# EasyEDA Pro project ProPrj_火车手动控制开关_2025-05-28.epro, schematic Schematic2
Board Name: PCB2; Create Date: 2025-04-24; Page Name: P1; Project Name: 火车手动控制开关; Schematic Name: Schematic2; Update Date: 2025-04-25; Company: 嘉立创EDA; Page Size: A4; Version: V1.0
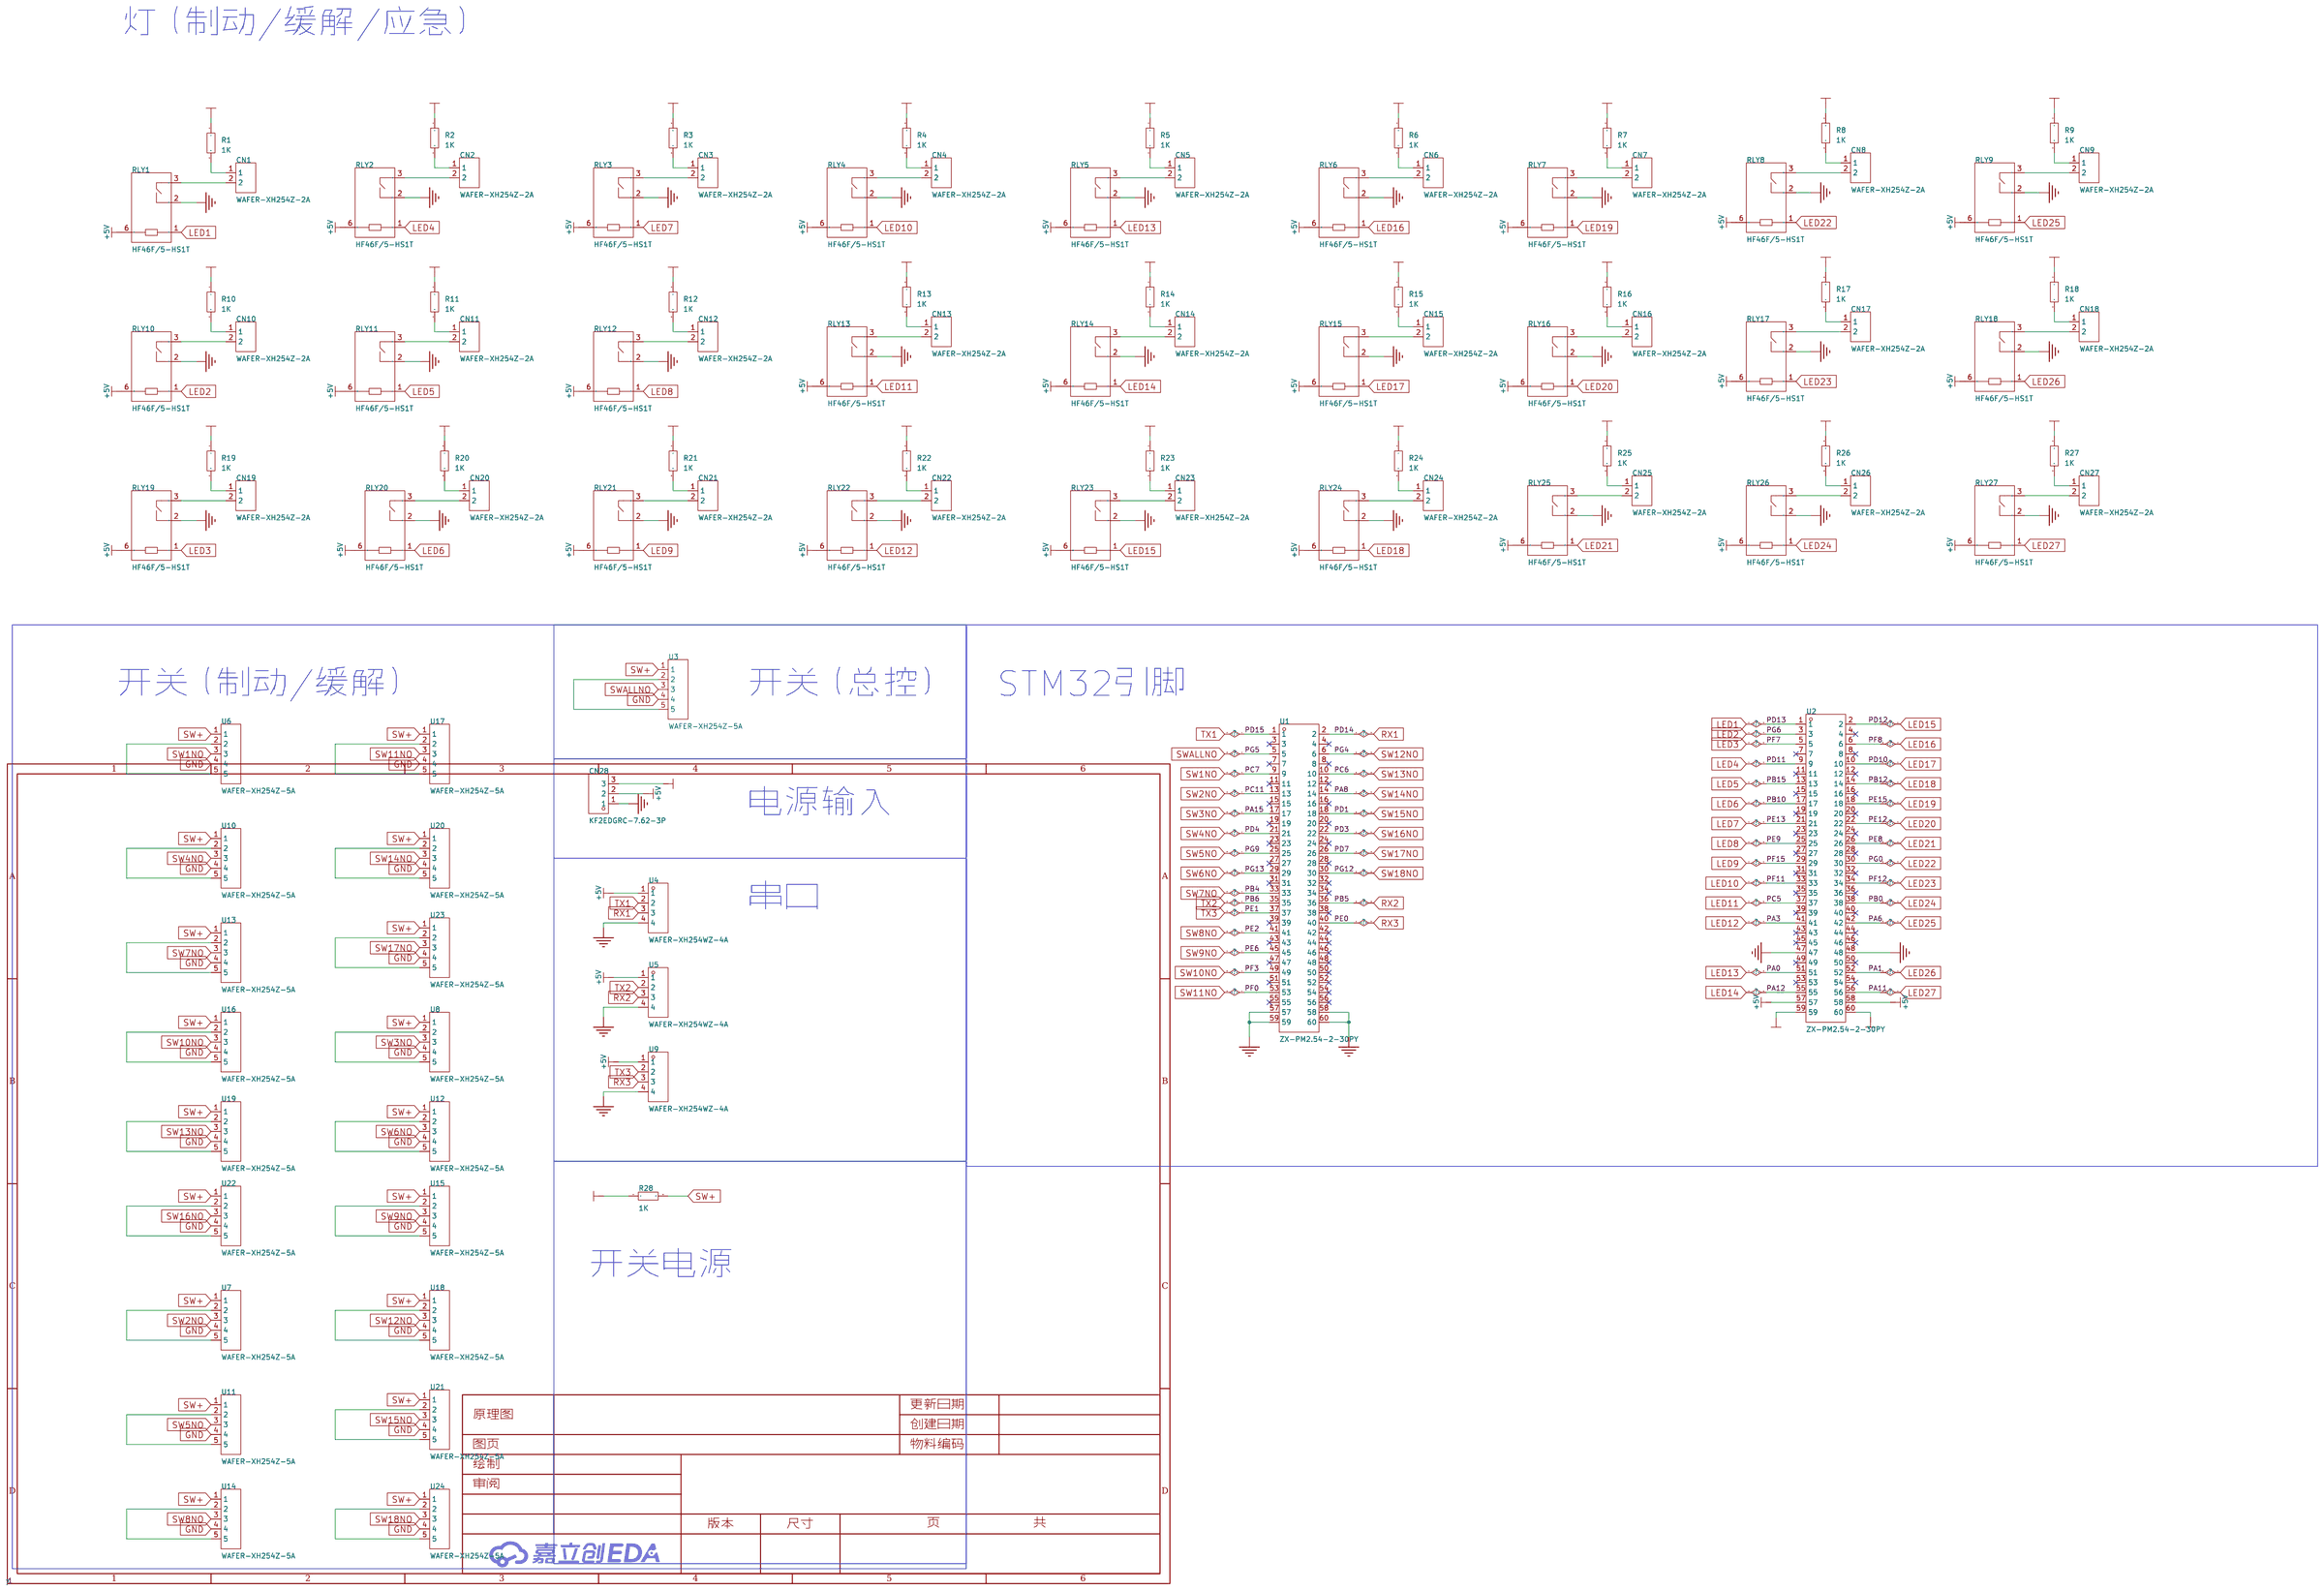
[diagram p2: schematic sheet]

## Parts
CN1  WAFER-XH254Z-2A  [CONN-TH_2P-P2.50_XH-2A_3045048]
CN2  WAFER-XH254Z-2A  [CONN-TH_2P-P2.50_XH-2A_3045048]
CN3  WAFER-XH254Z-2A  [CONN-TH_2P-P2.50_XH-2A_3045048]
CN4  WAFER-XH254Z-2A  [CONN-TH_2P-P2.50_XH-2A_3045048]
CN5  WAFER-XH254Z-2A  [CONN-TH_2P-P2.50_XH-2A_3045048]
CN6  WAFER-XH254Z-2A  [CONN-TH_2P-P2.50_XH-2A_3045048]
CN7  WAFER-XH254Z-2A  [CONN-TH_2P-P2.50_XH-2A_3045048]
CN8  WAFER-XH254Z-2A  [CONN-TH_2P-P2.50_XH-2A_3045048]
CN9  WAFER-XH254Z-2A  [CONN-TH_2P-P2.50_XH-2A_3045048]
CN10  WAFER-XH254Z-2A  [CONN-TH_2P-P2.50_XH-2A_3045048]
CN11  WAFER-XH254Z-2A  [CONN-TH_2P-P2.50_XH-2A_3045048]
CN12  WAFER-XH254Z-2A  [CONN-TH_2P-P2.50_XH-2A_3045048]
CN13  WAFER-XH254Z-2A  [CONN-TH_2P-P2.50_XH-2A_3045048]
CN14  WAFER-XH254Z-2A  [CONN-TH_2P-P2.50_XH-2A_3045048]
CN15  WAFER-XH254Z-2A  [CONN-TH_2P-P2.50_XH-2A_3045048]
CN16  WAFER-XH254Z-2A  [CONN-TH_2P-P2.50_XH-2A_3045048]
CN17  WAFER-XH254Z-2A  [CONN-TH_2P-P2.50_XH-2A_3045048]
CN18  WAFER-XH254Z-2A  [CONN-TH_2P-P2.50_XH-2A_3045048]
CN19  WAFER-XH254Z-2A  [CONN-TH_2P-P2.50_XH-2A_3045048]
CN20  WAFER-XH254Z-2A  [CONN-TH_2P-P2.50_XH-2A_3045048]
CN21  WAFER-XH254Z-2A  [CONN-TH_2P-P2.50_XH-2A_3045048]
CN22  WAFER-XH254Z-2A  [CONN-TH_2P-P2.50_XH-2A_3045048]
CN23  WAFER-XH254Z-2A  [CONN-TH_2P-P2.50_XH-2A_3045048]
CN24  WAFER-XH254Z-2A  [CONN-TH_2P-P2.50_XH-2A_3045048]
CN25  WAFER-XH254Z-2A  [CONN-TH_2P-P2.50_XH-2A_3045048]
CN26  WAFER-XH254Z-2A  [CONN-TH_2P-P2.50_XH-2A_3045048]
CN27  WAFER-XH254Z-2A  [CONN-TH_2P-P2.50_XH-2A_3045048]
CN28  KF2EDGRC-7.62-3P  [CONN-TH_3P-P7.62_KF2EDGRC-7.62-3P]
R1  1K  [R0603]
R2  1K  [R0603]
R3  1K  [R0603]
R4  1K  [R0603]
R5  1K  [R0603]
R6  1K  [R0603]
R7  1K  [R0603]
R8  1K  [R0603]
R9  1K  [R0603]
R10  1K  [R0603]
R11  1K  [R0603]
R12  1K  [R0603]
R13  1K  [R0603]
R14  1K  [R0603]
R15  1K  [R0603]
R16  1K  [R0603]
R17  1K  [R0603]
R18  1K  [R0603]
R19  1K  [R0603]
R20  1K  [R0603]
R21  1K  [R0603]
R22  1K  [R0603]
R23  1K  [R0603]
R24  1K  [R0603]
R25  1K  [R0603]
R26  1K  [R0603]
R27  1K  [R0603]
R28  1K  [R0603]
RLY1  HF46F/5-HS1T  [RELAYS-TH_HF46F-XX-HS1-XXX]
RLY2  HF46F/5-HS1T  [RELAYS-TH_HF46F-XX-HS1-XXX]
RLY3  HF46F/5-HS1T  [RELAYS-TH_HF46F-XX-HS1-XXX]
RLY4  HF46F/5-HS1T  [RELAYS-TH_HF46F-XX-HS1-XXX]
RLY5  HF46F/5-HS1T  [RELAYS-TH_HF46F-XX-HS1-XXX]
RLY6  HF46F/5-HS1T  [RELAYS-TH_HF46F-XX-HS1-XXX]
RLY7  HF46F/5-HS1T  [RELAYS-TH_HF46F-XX-HS1-XXX]
RLY8  HF46F/5-HS1T  [RELAYS-TH_HF46F-XX-HS1-XXX]
RLY9  HF46F/5-HS1T  [RELAYS-TH_HF46F-XX-HS1-XXX]
RLY10  HF46F/5-HS1T  [RELAYS-TH_HF46F-XX-HS1-XXX]
RLY11  HF46F/5-HS1T  [RELAYS-TH_HF46F-XX-HS1-XXX]
RLY12  HF46F/5-HS1T  [RELAYS-TH_HF46F-XX-HS1-XXX]
RLY13  HF46F/5-HS1T  [RELAYS-TH_HF46F-XX-HS1-XXX]
RLY14  HF46F/5-HS1T  [RELAYS-TH_HF46F-XX-HS1-XXX]
RLY15  HF46F/5-HS1T  [RELAYS-TH_HF46F-XX-HS1-XXX]
RLY16  HF46F/5-HS1T  [RELAYS-TH_HF46F-XX-HS1-XXX]
RLY17  HF46F/5-HS1T  [RELAYS-TH_HF46F-XX-HS1-XXX]
RLY18  HF46F/5-HS1T  [RELAYS-TH_HF46F-XX-HS1-XXX]
RLY19  HF46F/5-HS1T  [RELAYS-TH_HF46F-XX-HS1-XXX]
RLY20  HF46F/5-HS1T  [RELAYS-TH_HF46F-XX-HS1-XXX]
RLY21  HF46F/5-HS1T  [RELAYS-TH_HF46F-XX-HS1-XXX]
RLY22  HF46F/5-HS1T  [RELAYS-TH_HF46F-XX-HS1-XXX]
RLY23  HF46F/5-HS1T  [RELAYS-TH_HF46F-XX-HS1-XXX]
RLY24  HF46F/5-HS1T  [RELAYS-TH_HF46F-XX-HS1-XXX]
RLY25  HF46F/5-HS1T  [RELAYS-TH_HF46F-XX-HS1-XXX]
RLY26  HF46F/5-HS1T  [RELAYS-TH_HF46F-XX-HS1-XXX]
RLY27  HF46F/5-HS1T  [RELAYS-TH_HF46F-XX-HS1-XXX]
U1  ZX-PM2.54-2-30PY  [HDR-TH_60P-P2.54-V-F-R2-C30-S2.54]
U2  ZX-PM2.54-2-30PY  [HDR-TH_60P-P2.54-V-F-R2-C30-S2.54]
U3  WAFER-XH254Z-5A  [CONN-TH_5P-P2.50_WAFER-XH254Z-5A]
U4  WAFER-XH254WZ-4A  [CONN-TH_4P-P2.50_WAFER-XH254WZ-4A]
U5  WAFER-XH254WZ-4A  [CONN-TH_4P-P2.50_WAFER-XH254WZ-4A]
U6  WAFER-XH254Z-5A  [CONN-TH_5P-P2.50_WAFER-XH254Z-5A]
U7  WAFER-XH254Z-5A  [CONN-TH_5P-P2.50_WAFER-XH254Z-5A]
U8  WAFER-XH254Z-5A  [CONN-TH_5P-P2.50_WAFER-XH254Z-5A]
U9  WAFER-XH254WZ-4A  [CONN-TH_4P-P2.50_WAFER-XH254WZ-4A]
U10  WAFER-XH254Z-5A  [CONN-TH_5P-P2.50_WAFER-XH254Z-5A]
U11  WAFER-XH254Z-5A  [CONN-TH_5P-P2.50_WAFER-XH254Z-5A]
U12  WAFER-XH254Z-5A  [CONN-TH_5P-P2.50_WAFER-XH254Z-5A]
U13  WAFER-XH254Z-5A  [CONN-TH_5P-P2.50_WAFER-XH254Z-5A]
U14  WAFER-XH254Z-5A  [CONN-TH_5P-P2.50_WAFER-XH254Z-5A]
U15  WAFER-XH254Z-5A  [CONN-TH_5P-P2.50_WAFER-XH254Z-5A]
U16  WAFER-XH254Z-5A  [CONN-TH_5P-P2.50_WAFER-XH254Z-5A]
U17  WAFER-XH254Z-5A  [CONN-TH_5P-P2.50_WAFER-XH254Z-5A]
U18  WAFER-XH254Z-5A  [CONN-TH_5P-P2.50_WAFER-XH254Z-5A]
U19  WAFER-XH254Z-5A  [CONN-TH_5P-P2.50_WAFER-XH254Z-5A]
U20  WAFER-XH254Z-5A  [CONN-TH_5P-P2.50_WAFER-XH254Z-5A]
U21  WAFER-XH254Z-5A  [CONN-TH_5P-P2.50_WAFER-XH254Z-5A]
U22  WAFER-XH254Z-5A  [CONN-TH_5P-P2.50_WAFER-XH254Z-5A]
U23  WAFER-XH254Z-5A  [CONN-TH_5P-P2.50_WAFER-XH254Z-5A]
U24  WAFER-XH254Z-5A  [CONN-TH_5P-P2.50_WAFER-XH254Z-5A]

## Library data of the parts
CN1-CN27 = WAFER-XH254Z-2A: 插针结构:1x2P;间距:2.54mm;安装方式:直插;参考系列:XH;总PIN数:2P;排数:1;每排PIN数:2;额定电流:3A;工作温度范围:-25℃~+85℃;; Supplier Part: C7432682; Manufacturer: HANBO(汉博); Supplier Footprint: 插件,P=2.5mm; JLCPCB Part Class: 扩展库; Datasheet: https://atta.szlcsc.com/upload/public/pdf/source/20230718/3B4FABA5D38EFB02DAF74E7C2B33D98F.pdf; Supplier: LCSC; Pins Structure: 1x2P; Pitch: 2.54mm; Mounting Style: 直插; Reference Series: XH; Number of Pins: 2P; Number of Rows: 1; Number of PINs Per Row: 2; Current Rating (Max): 3A; Operating Temperature Range: -25℃~+85℃
CN28 = KF2EDGRC-7.62-3P: 连接器类型:板端/插座-闭口;结构:1x3P;间距:7.62mm;颜色:绿色;安装方式:弯针;排数:1;每排PIN数:3;额定电流:15A;额定电压:400V;工作温度范围:-40℃~+105℃;; LCSC Part Name: 7.62mm 1x3P 排数:1 每排P数:3; Supplier Part: C441247; Manufacturer: KEFA(科发); Supplier Footprint: 弯插,P=7.62mm; JLCPCB Part Class: 扩展库; Datasheet: https://atta.szlcsc.com/upload/public/pdf/source/20230331/98017C42E55659E793A45F1EF0D85FE6.pdf; Supplier: LCSC; Connector Type: 板端/插座-闭口; Structure: 1x3P; Pitch: 7.62mm; Color: 绿色; Mounting Style: 弯针; Number of Pins: 3P; Number of Rows: 1; Number of PINs Per Row: 3; Current Rating (Max): 15A; Voltage Rating (Max): 400V; Operating Temperature Range: -40℃~+105℃
R1-R28 = Res_0603: Supplier Footprint: 0603
RLY1-RLY27 = HF46F/5-HS1T_C3036134: 线圈电压:5V;触点形式:一组常开:1A(单刀单掷-常开);触点容量(电阻负载):5A@30VDC；5A@250VAC;最大切换电压:277V@AC；30V@DC;最大切换电流:5A;; LCSC Part Name: 超小型中功率5V继电器 单刀单掷-常开; Supplier Part: C3036134; Manufacturer: HF(宏发); Supplier Footprint: 插件,7x20.5mm; JLCPCB Part Class: Extended Part; Datasheet: https://atta.szlcsc.com/upload/public/pdf/source/20180301/C182930_15198945723621384141.pdf; Supplier: LCSC; Coil Voltage: 5V; Contact Form: 一组常开:1A(单刀单掷-常开); Pin Number: 4; Contact Rating: 5A@30VDC；5A@250VAC; Maximum Switching Voltage: 277V@AC；30V@DC; Coil Rated Power: 200mW; Contact Material: AgSnO2; Maximum Switching Current: 5A; Coil Type: 无极性-单线圈; Coil Resistance: 125Ω; Contact Resistance: 100mΩ; Operate Time: 10ms; Release Time: 10ms; Operating Temperature: -40℃~+85℃
U1 U2 = ZX-PM2.54-2-30PY: 插孔结构:2x30P;间距:2.54mm;行距:2.54mm;圆孔/方孔:方孔;安装类型:直插;排数:双排;总孔位数:60P;额定电流:-;额定电压:1kV;插孔方向:顶部;塑高:8.5mm;触头材质:-;触头镀层:金;工作温度范围:-40℃~+105℃;焊接温度(最大值):260℃@5S;; LCSC Part Name: 2x30P 间距:2.54mm 直插; Supplier Part: C7499356; Manufacturer: Megastar(兆星); Supplier Footprint: 插件,P=2.54mm; JLCPCB Part Class: 扩展库; Datasheet: https://atta.szlcsc.com/upload/public/pdf/source/20231122/23E1107B34356833C267F6B6E856DE02.pdf; Supplier: LCSC; Holes Structure: 2x30P; Pitch: 2.54mm; Row Spacing: 2.54mm; Circular Hole / Square Hole: 方孔; Mounting Type: 直插; Number of Rows: 双排; Number of Holes: 60P; Voltage Rating (Max): 1kV; Holes Direction: 顶部; Insulation Height: 8.5mm; Contact Plating: 金; Operating Temperature Range: -40℃~+105℃; Soldering Temperature(Max): 260℃@5S
U3 U6-U8 U10-U24 = WAFER-XH254Z-5A: 插针结构:1x5P;间距:2.54mm;安装方式:直插;参考系列:XH;总PIN数:5P;排数:1;每排PIN数:5;额定电流:3A;工作温度:-25℃~+85℃;; Supplier Part: C7432685; Manufacturer: HANBO(汉博); Supplier Footprint: 插件,P=2.5mm; JLCPCB Part Class: 扩展库; Datasheet: https://atta.szlcsc.com/upload/public/pdf/source/20230718/3B4FABA5D38EFB02DAF74E7C2B33D98F.pdf; Supplier: LCSC; Pins Structure: 1x5P; Pitch: 2.54mm; Mounting Type: 直插; Reference Series: XH; Number of Pins: 5P; Number of Rows: 1; Number of PINs Per Row: 5; Current Rating: 3A; Operating Temperature: -25℃~+85℃
U4 U5 U9 = WAFER-XH254WZ-4A: 插针结构:1x4P;间距:2.54mm;安装方式:弯插;参考系列:XH;总PIN数:4P;排数:1;每排PIN数:4;额定电流:3A;工作温度范围:-25℃~+85℃;; Supplier Part: C7432693; Manufacturer: HANBO(汉博); Supplier Footprint: 插件,P=2.5mm; JLCPCB Part Class: Extended Part; Datasheet: https://atta.szlcsc.com/upload/public/pdf/source/20230721/127D646758C1D4B76FEF9901992220E1.pdf; Supplier: LCSC; Pins Structure: 1x4P; Pitch: 2.54mm; Mounting Style: 弯插; Reference Series: XH; Number of Pins: 4P; Number of Rows: 1; Number of PINs Per Row: 4; Current Rating (Max): 3A; Operating Temperature Range: -25℃~+85℃

## Nets
3.3V: U2.59 U2.60
+5V: CN28.2 RLY1.6 RLY2.6 RLY3.6 RLY4.6 RLY5.6 RLY6.6 RLY7.6 RLY8.6 RLY9.6 RLY10.6 RLY11.6 RLY12.6 RLY13.6 RLY14.6 RLY15.6 RLY16.6 RLY17.6 RLY18.6 RLY19.6 RLY20.6 RLY21.6 RLY22.6 RLY23.6 RLY24.6 RLY25.6 RLY26.6 RLY27.6 U2.57 U2.58 U4.1 U5.1 U9.1
+24V: CN28.3 R1.1 R2.1 R3.1 R4.1 R5.1 R6.1 R7.1 R8.1 R9.1 R10.1 R11.1 R12.1 R13.1 R14.1 R15.1 R16.1 R17.1 R18.1 R19.1 R20.1 R21.1 R22.1 R23.1 R24.1 R25.1 R26.1 R27.1 R28.1
GND: CN28.1 RLY1.2 RLY2.2 RLY3.2 RLY4.2 RLY5.2 RLY6.2 RLY7.2 RLY8.2 RLY9.2 RLY10.2 RLY11.2 RLY12.2 RLY13.2 RLY14.2 RLY15.2 RLY16.2 RLY17.2 RLY18.2 RLY19.2 RLY20.2 RLY21.2 RLY22.2 RLY23.2 RLY24.2 RLY25.2 RLY26.2 RLY27.2 U1.57 U1.58 U1.59 U1.60 U2.47 U2.48 U3.4 U4.4 U5.4 U6.4 U7.4 U8.4 U9.4 U10.4 U11.4 U12.4 U13.4 U14.4 U15.4 U16.4 U17.4 U18.4 U19.4 U20.4 U21.4 U22.4 U23.4 U24.4
LED1: RLY1.1 U2.1
LED2: RLY10.1 U2.3
LED3: RLY19.1 U2.5
LED4: RLY2.1 U2.9
LED5: RLY11.1 U2.13
LED6: RLY20.1 U2.17
LED7: RLY3.1 U2.21
LED8: RLY12.1 U2.25
LED9: RLY21.1 U2.29
LED10: RLY4.1 U2.33
LED11: RLY13.1 U2.37
LED12: RLY22.1 U2.41
LED13: RLY5.1 U2.51
LED14: RLY14.1 U2.55
LED15: RLY23.1 U2.2
LED16: RLY6.1 U2.6
LED17: RLY15.1 U2.10
LED18: RLY24.1 U2.14
LED19: RLY7.1 U2.18
LED20: RLY16.1 U2.22
LED21: RLY25.1 U2.26
LED22: RLY8.1 U2.30
LED23: RLY17.1 U2.34
LED24: RLY26.1 U2.38
LED25: RLY9.1 U2.42
LED26: RLY18.1 U2.52
LED27: RLY27.1 U2.56
PA8: U1.14 U20.3
PA15: U1.17 U8.3
PB4: U1.33 U13.3
PB5: U1.36 U5.3
PB6: U1.35 U5.2
PC6: U1.10 U19.3
PC7: U1.9 U6.3
PC11: U1.13 U7.3
PD1: U1.18 U21.3
PD3: U1.22 U22.3
PD4: U1.21 U10.3
PD7: U1.26 U23.3
PD14: U1.2 U4.3
PD15: U1.1 U4.2
PE0: U1.40 U9.3
PE1: U1.37 U9.2
PE2: U1.41 U14.3
PE6: U1.45 U15.3
PF0: U1.53 U17.3
PF3: U1.49 U16.3
PG4: U1.6 U18.3
PG5: U1.5 U3.3
PG9: U1.25 U11.3
PG12: U1.30 U24.3
PG13: U1.29 U12.3
SW+: R28.2 U3.1 U6.1 U7.1 U8.1 U10.1 U11.1 U12.1 U13.1 U14.1 U15.1 U16.1 U17.1 U18.1 U19.1 U20.1 U21.1 U22.1 U23.1 U24.1
$1N2371: U6.2 U6.5
$1N4179: U7.2 U7.5
$1N4270: U8.2 U8.5
$1N4523: U10.2 U10.5
$1N4533: U11.2 U11.5
$1N4543: U12.2 U12.5
$1N4796: U13.2 U13.5
$1N4806: U14.2 U14.5
$1N4816: U15.2 U15.5
$1N5069: U16.2 U16.5
$1N5079: U17.2 U17.5
$1N5089: U18.2 U18.5
$1N5342: U19.2 U19.5
$1N5352: U20.2 U20.5
$1N5362: U21.2 U21.5
$1N5615: U22.2 U22.5
$1N5625: U23.2 U23.5
$1N5635: U24.2 U24.5
$1N6166: CN1.2 RLY1.3
$1N6202: CN1.1 R1.2
$1N6298: U3.2 U3.5
$1N6468: CN2.2 RLY2.3
$1N6472: CN2.1 R2.2
$1N6640: CN3.1 R3.2
$1N6645: CN3.2 RLY3.3
$1N7138: CN4.2 RLY4.3
$1N7142: CN4.1 R4.2
$1N7151: CN5.2 RLY5.3
$1N7155: CN5.1 R5.2
$1N7164: CN6.2 RLY6.3
$1N7168: CN6.1 R6.2
$1N7666: CN7.2 RLY7.3
$1N7670: CN7.1 R7.2
$1N7679: CN8.2 RLY8.3
$1N7683: CN8.1 R8.2
$1N7692: CN9.2 RLY9.3
$1N7696: CN9.1 R9.2
$1N9148: CN10.2 RLY10.3
$1N9152: CN10.1 R10.2
$1N9161: CN11.2 RLY11.3
$1N9165: CN11.1 R11.2
$1N9174: CN12.2 RLY12.3
$1N9178: CN12.1 R12.2
$1N9187: CN13.2 RLY13.3
$1N9191: CN13.1 R13.2
$1N9200: CN14.2 RLY14.3
$1N9204: CN14.1 R14.2
$1N9213: CN15.2 RLY15.3
$1N9217: CN15.1 R15.2
$1N9226: CN16.2 RLY16.3
$1N9230: CN16.1 R16.2
$1N9239: CN17.2 RLY17.3
$1N9243: CN17.1 R17.2
$1N9252: CN18.2 RLY18.3
$1N9256: CN18.1 R18.2
$1N10732: CN19.2 RLY19.3
$1N10736: CN19.1 R19.2
$1N10745: CN20.2 RLY20.3
$1N10749: CN20.1 R20.2
$1N10758: CN21.2 RLY21.3
$1N10762: CN21.1 R21.2
$1N10771: CN22.2 RLY22.3
$1N10775: CN22.1 R22.2
$1N10784: CN23.2 RLY23.3
$1N10788: CN23.1 R23.2
$1N10797: CN24.2 RLY24.3
$1N10801: CN24.1 R24.2
$1N10810: CN25.2 RLY25.3
$1N10814: CN25.1 R25.2
$1N10823: CN26.2 RLY26.3
$1N10827: CN26.1 R26.2
$1N10836: CN27.2 RLY27.3
$1N10840: CN27.1 R27.2

Not connected (* = marked no-connect by the designer): U1 3* 4* 7* 8* 11* 12* 15* 16* 19* 20* 23* 24* 27* 28* 31* 32* 34* 38* 39* 42* 43* 44* 46* 47* 48* 50* 51* 52* 54* 55* 56*; U2 4* 7* 8* 11* 12* 15* 16* 19* 20* 23* 24* 27* 28* 31* 32* 35* 36* 39* 40* 43* 44* 45* 46* 49* 50* 53* 54*

## Notes on the sheet
- 灯（制动/缓解/应急）
- 开关（制动/缓解）
- 开关（总控）
- STM32引脚
- 电源输入
- 串口
- 开关电源
